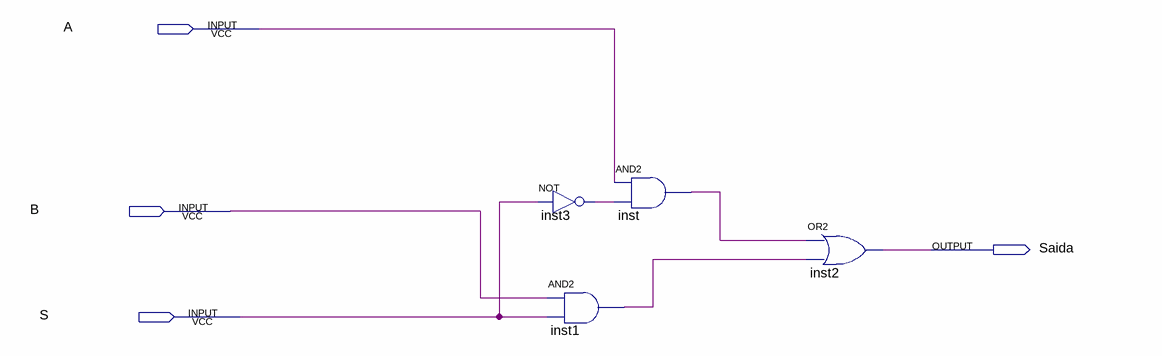
[diagram p0: schematic sheet]
// Quartus schematic MUX2BITS.bdf as structural Verilog: 4 symbols, 4 pins
module MUX2BITS (
  input  A,
  input  B,
  input  S,
  output Saida
);

  wire inst1_out, inst3_out, inst_out;

  not inst3 (inst3_out, S);
  and inst1 (inst1_out, B, S);
  and inst (inst_out, A, inst3_out);
  or inst2 (Saida, inst_out, inst1_out);
endmodule
